# Altium schematic sheet 100-677-01-00 BCB.SchDoc: Battery Control Board (part 2 of 3)
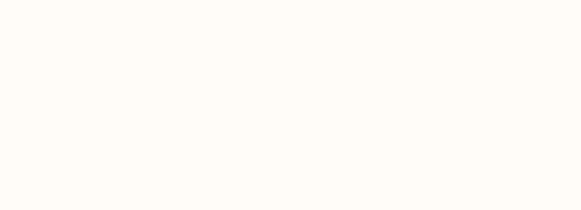
[diagram p6: 100-677-01-00 BCB.SchDoc, bottom right]
## Library data of the parts
C1 C13 C24 C33 C40 = Cap 1uF 0805: CAP MLCC 1UF 25V X7R 10% SM0805 ROHS; Manufacturer: TDK Corporation; Manufacturer Part Number: C2012X7R1E105K125AB; Capacitance: 1.0µF; Tolerance: ?0%; Supplier 1: Digi-Key; Supplier Part Number 1: 445-1354-6-ND; RoHS: RoHS Compliant; Category: Capacitors; Stock 1: 260747; Pricing 1: 1=0.16, 10=0.11, 100=0.0523, 250=0.044, 500=0.03686, 1000=0.03025 (USD); Voltage - Rated: 25V; Temperature Coefficient: X7R; Mounting Type: Surface Mount, MLCC; Operating Temperature: -55°C ~ 125°C; Applications: General Purpose; Ratings: -; Package / Case: 0805 (2012 Metric); Size / Dimension: 0.079" L x 0.049" W (2.00mm x 1.25mm); Height - Seated (Max): -; Thickness (Max): 0.057" (1.45mm); Lead Spacing: -; Features: -; Packaging: Digi-Reel畮ISHIDDEN=T; Lead Style: -; ComponentLink1URL: http://www.tdk.com/pdf/general_B11.pdf; ComponentLink1Description: http://www.tdk.com/pdf/general_B11.pdf
C2 C3 C5-C9 C12 C14 C15 C17 C20 C21 C25 C26 C28 C29 C31 C32 C34 C37 C41-C44 C103-C105 C108 C113 C114 C132 C134 = Cap 0.1uF 0603: CAP CER 0.1UF 25V 10% X7R 0603; Manufacturer Part Number 1: C0603C104K3RACTU; Manufacturer 1: Kemet; Capacitance: 0.1μF; Supplier Part Number: 399-1281-1-ND; Voltage - Rated: 25V; RoHS: RoHS Compliant; Category: Capacitors; Supplier: Digi-Key; Tolerance: ±10%; Temperature Coefficient: X7R; Mounting Type: Surface Mount, MLCC; Lead Spacing: -; Thickness (Max): 0.034" (0.87mm); Height - Seated (Max): -; Ratings: -; Size / Dimension: 0.063" L x 0.031" W (1.60mm x 0.80mm); Applications: General Purpose; Operating Temperature: -55°C ~ 125°C; Lead Style: -; Packaging: Cut Tape (CT); Package / Case: 0603 (1608 Metric); Features: -
C4 C16 C47 = Cap 10nF 0603: CAP MLCC 10NF 25V X7R 10% SM0603 ROHS; Manufacturer: TDK Corporation; Manufacturer Part Number: C1608X7R1E103K080AA; Capacitance: 10000pF; Tolerance: ?0%; Supplier 1: Digi-Key; Supplier Part Number 1: 445-5100-1-ND; Stock 1: 71278; Pricing 1: 1=0.1, 10=0.024, 100=0.011, 250=0.009, 500=0.0077, 1000=0.006 (USD); ComponentLink1URL: http://www.tdk.com/pdf/general_B11.pdf; ComponentLink1Description: http://www.tdk.com/pdf/general_B11.pdf; RoHS: RoHS Compliant; Category: Capacitors; Voltage - Rated: 25V; Temperature Coefficient: X7R; Mounting Type: Surface Mount, MLCC; Operating Temperature: -55°C ~ 125°C; Applications: General Purpose; Ratings: -; Package / Case: 0603 (1608 Metric); Size / Dimension: 0.063" L x 0.031" W (1.60mm x 0.80mm); Height - Seated (Max): -; Thickness (Max): 0.037" (0.95mm); Lead Spacing: -; Features: -; Packaging: Cut Tape (CT); Lead Style: -
C10 C19 C22 C36 C38 C46 C102 = Cap 3.3uF 0805: CAP MLCC 3.3UF 16V X5R 20% SM0805 ROHS; Manufacturer: TDK Corporation; Manufacturer Part Number: C2012X7R1C335K125AB; Capacitance: 3.3µF; Tolerance: ?0%; Temperature Coefficient: X7R; Supplier 1: Digi-Key; Supplier Part Number 1: 445-7582-1-ND; RoHS: RoHS Compliant; Category: Capacitors; Stock 1: 19266; Pricing 1: 1=0.36, 10=0.315, 100=0.1575, 250=0.126, 500=0.11476, 1000=0.1035 (USD); Voltage - Rated: 16V; Mounting Type: Surface Mount, MLCC; Operating Temperature: -55°C ~ 125°C; Applications: General Purpose; Ratings: -; Package / Case: 0805 (2012 Metric); Size / Dimension: 0.079" L x 0.049" W (2.00mm x 1.25mm); Height - Seated (Max): -; Thickness (Max): 0.057" (1.45mm); Lead Spacing: -; Features: -; Packaging: Cut Tape (CT); Lead Style: -; ComponentLink1URL: http://www.tdk.com/pdf/general_B11.pdf; ComponentLink1Description: http://www.tdk.com/pdf/general_B11.pdf
C11 C23 C39 C45 = Cap 0.47uF 0603: CAP MLCC 0.47UF 25V X5R 10% SM0603 ROHS; Manufacturer: TDK Corporation; Manufacturer Part Number: C1608X5R1E474K080AC; Capacitance: 0.47µF; Tolerance: ?0%; Supplier 1: Digi-Key; Supplier Part Number 1: 445-5144-1-ND; RoHS: RoHS Compliant; Category: Capacitors; Stock 1: 22553; Pricing 1: 1=0.15, 10=0.1, 100=0.0475, 250=0.04, 500=0.0335, 1000=0.0275 (USD); Voltage - Rated: 25V; Temperature Coefficient: X5R; Mounting Type: Surface Mount, MLCC; Operating Temperature: -55°C ~ 85°C; Applications: General Purpose; Ratings: -; Package / Case: 0603 (1608 Metric); Size / Dimension: 0.063" L x 0.031" W (1.60mm x 0.80mm); Height - Seated (Max): -; Thickness (Max): 0.037" (0.95mm); Lead Spacing: -; Features: -; Packaging: Cut Tape (CT); Lead Style: -; ComponentLink1URL: http://www.tdk.com/pdf/general_B11.pdf; ComponentLink1Description: http://www.tdk.com/pdf/general_B11.pdf
C18 = Cap 1uF 0603: CAP, CERAMIC, 1UF, 16V, X7R, 0603; Manufacturer 1: MURATA; Manufacturer Part Number 1: GRM188R71C105KA12D; Capacitance: 1; Description 1: MURATA - GRM188R71C105KA12D - CAP, CERAMIC, 1UF, 16V, X7R, 0603; Capacitance Tolerance: ± 10%; Dielectric Characteristic: X7; Voltage Rating: 16; Capacitor Case Style: 0603 [1608 Metric]; Capacitor Terminals: SMD; Supplier 1: Newark; Supplier Part Number 1: 14T3313; Stock 1: 1586; Pricing 1: 10=0.129, 250=0.097, 500=0.086, 1000=0.078, 5000=0.071 (USD); ComponentLink1URL: http://www.farnell.com/datasheets/608985.pdf; ComponentLink1Description: http://www.farnell.com/datasheets/608985.pdf; RoHS 1: YES; Operating Temperature Range: -55
C27 C30 C50 C51 C129 C130 = Cap 0.1uF 1206: CAP MLCC 0.1UF 250V 10% X7R 1206; Manufacturer: TDK Corporation; Manufacturer Part Number: C3216X7R2E104K160AA; Capacitance: 0.1µF; Tolerance: ?0%; Supplier 1: Digi-Key; Supplier Part Number 1: 445-2287-1-ND; RoHS: RoHS Compliant; Category: Capacitors; Stock 1: 169761; Pricing 1: 1=0.34, 10=0.28, 100=0.14, 250=0.105, 500=0.09276, 1000=0.08225 (USD); Voltage - Rated: 250V; Temperature Coefficient: X7R; Mounting Type: Surface Mount, MLCC; Operating Temperature: -55°C ~ 125°C; Applications: General Purpose; Ratings: -; Package / Case: 1206 (3216 Metric); Size / Dimension: 0.126" L x 0.063" W (3.20mm x 1.60mm); Height - Seated (Max): -; Thickness (Max): 0.071" (1.80mm); Lead Spacing: -; Features: -; Packaging: Cut Tape (CT); Lead Style: -; ComponentLink1URL: http://www.tdk.com/pdf/mid_volt_B11.pdf; ComponentLink1Description: http://www.tdk.com/pdf/mid_volt_B11.pdf
C48 C49 = Cap 2.2nF 1812: CAP MLCC 2.2NF 2KV 10% SM1812 ROHS; Manufacturer: TDK Corporation; Manufacturer Part Number: C4532X7R3D222K130KA; Capacitance: 2200pF; Voltage - Rated: 2000V (2kV); Tolerance: ?0%; Temperature Coefficient: X7R; Supplier 1: Digi-Key; Supplier Part Number 1: 445-2389-1-ND; RoHS: RoHS Compliant; Category: Capacitors; Stock 1: 25506; Pricing 1: 1=0.81, 10=0.689, 100=0.403, 250=0.338, 500=0.3055 (USD); Mounting Type: Surface Mount, MLCC; Operating Temperature: -55°C ~ 125°C; Applications: General Purpose; Ratings: -; Package / Case: 1812 (4532 Metric); Size / Dimension: 0.177" L x 0.126" W (4.50mm x 3.20mm); Height - Seated (Max): -; Thickness (Max): 0.059" (1.50mm); Lead Spacing: -; Features: High Voltage; Packaging: Cut Tape (CT); Lead Style: -; ComponentLink1URL: http://www.tdk.com/pdf/high_volt_B11.pdf; ComponentLink1Description: http://www.tdk.com/pdf/high_volt_B11.pdf
C52 C106 C107 C123 C124 = Cap NP 0603: Do not Populate
C100 C101 = Cap 2.2uF 0805: CAP CER 2.2UF 6.3V 20% X5R 0805; Manufacturer 1: TDK Corporation; Manufacturer Part Number: C2012X5R0J225M085AA; Capacitance: 2.2μF; Category 1: Capacitors; Supplier 1: Digi-Key; Supplier Part Number 1: 445-7667-1-ND; Stock 1: 7050; Pricing 1: 1=0.19, 10=0.13, 100=0.0618, 250=0.052, 500=0.04356, 1000=0.03575 (USD); Voltage - Rated: 6.3V; Tolerance: ±20%; Temperature Coefficient: X5R; Mounting Type: Surface Mount, MLCC; Operating Temperature: -55°C ~ 85°C; Applications: General Purpose; Ratings: -; Package / Case: 0805 (2012 Metric); Size / Dimension: 0.079" L x 0.049" W (2.00mm x 1.25mm); Height - Seated (Max): -; Thickness (Max): 0.037" (0.95mm); Lead Spacing: -; Features: -; Packaging: Cut Tape (CT); Lead Style: -; ComponentLink1URL: http://product.tdk.com/capacitor/mlcc/en/documents/mlcc_commercial_general_en.pdf; ComponentLink1Description: http://product.tdk.com/capacitor/mlcc/en/documents/mlcc_commercial_general_en.pdf; RoHS 1: RoHS Compliant; Description 1: CAP CER 2.2UF 6.3V 20% X5R 0805
C109-C112 C115-C122 C125-C128 = Cap 2200pF 0603: ACap 2200PF 100V, X7R, 10%, 0603; Manufacturer 1: AVX; Manufacturer Part Number: 06031C222KAT2A; Capacitance: 2200; Description 1: AVX - 06031C222KAT2A - CAPACITOR CERAMIC 2200PF 100V, X7R, 10%, 0603; Dielectric Characteristic: X7; Voltage Rating: 100; Capacitor Case Style: 0603 [1608 Metric]; Capacitor Terminals: SMD; No. of Pins: 2; Supplier 1: Newark; Supplier Part Number 1: 96K4759; RoHS 1: YES; Stock 1: 41497; Pricing 1: 1=0.1, 50=0.071, 100=0.046, 500=0.034, 1000=0.023, 4000=0.015, 8000=0.014 (USD); Capacitance Tolerance: ± 10%; ComponentLink1URL: http://avx.com/docs/Catalogs/cx7r.pdf; ComponentLink1Description: http://avx.com/docs/Catalogs/cx7r.pdf
C131 C133 = Cap 10uF 1206: CAP CER 10UF 25V 10% X5R 1206; Manufacturer 1: Kemet; Manufacturer Part Number: C1206C106K3PACTU; Category 1: Capacitors; Capacitance: 10μF; Supplier 1: Digi-Key; Supplier Part Number 1: 399-6784-1-ND; RoHS 1: RoHS Compliant; Description 1: CAP CER 10UF 25V 10% X5R 1206; Stock 1: 39380; Pricing 1: 1=0.35, 10=0.294, 50=0.1656, 100=0.1472, 250=0.1104, 500=0.09752, 1000=0.08648 (USD); Voltage - Rated: 25V; Tolerance: ±10%; Temperature Coefficient: X5R; Mounting Type: Surface Mount, MLCC; Operating Temperature: -55°C ~ 85°C; Applications: General Purpose; Ratings: -; Package / Case: 1206 (3216 Metric); Size / Dimension: 0.126" L x 0.063" W (3.20mm x 1.60mm); Height - Seated (Max): -; Thickness (Max): 0.071" (1.80mm); Lead Spacing: -; Features: -; Packaging: Cut Tape (CT); Lead Style: -; ComponentLink1URL: http://www.kemet.com/datasheets&C1206C106K3PACTU; ComponentLink1Description: http://www.kemet.com/datasheets&C1206C106K3PACTU
D1 D121 = Diode Standard SOT-23: DIODE, 200mA, 250V, SOT-23; Manufacturer 1: FAIRCHILD SEMICONDUCTOR; Description 1: FAIRCHILD SEMICONDUCTOR - BAS21 - STANDARD DIODE, 200mA, 250V, SOT-23; Supplier 1: Newark; Supplier Part Number 1: 18C5749; Stock 1: 14809; Pricing 1: 1=0.133, 10=0.121, 25=0.104, 100=0.085, 250=0.067, 500=0.047, 1000=0.032, 2500=0.029 (USD); RoHS 1: YES; ComponentLink1URL: http://www.farnell.com/datasheets/82312.pdf; ComponentLink1Description: http://www.farnell.com/datasheets/82312.pdf; ComponentLink2URL: http://www.fairchildsemi.com/ds/BA/BAS21.pdf; ComponentLink2Description: http://www.fairchildsemi.com/ds/BA/BAS21.pdf; Manufacturer Part Number: BAS21
D100 = Diode Zener 5.6V SOD123: DIODE ZENER 5.6V 500MW SOD-123; Manufacturer 1: ON Semiconductor; Manufacturer Part Number: MMSZ4690T1G; Description 1: DIODE ZENER 5.6V 500MW SOD123; Category 1: Discrete Semiconductor Products; Voltage - Forward (Vf) (Max) @ If: 900mV @ 10mA; Current - Reverse Leakage @ Vr: 10μA @ 4V; Tolerance: ±5%; Supplier 1: Digi-Key; Supplier Part Number 1: MMSZ4690T1GOSTR-ND; RoHS 1: RoHS Compliant; Stock 1: 18000; Pricing 1: 3000=0.03979, 6000=0.0346, 15000=0.02941 (USD); Voltage - Zener (Nom) (Vz): 5.6V; Power - Max: 500mW; Impedance (Max) (Zzt): -; Mounting Type: Surface Mount; Package / Case: SOD-123; Supplier Device Package: SOD-123; Packaging: Tape & Reel (TR); Operating Temperature: -55°C ~ 150°C; ComponentLink1URL: http://www.onsemi.com/pub_link/Collateral/MMSZ4678T1-D.PDF; ComponentLink1Description: http://www.onsemi.com/pub_link/Collateral/MMSZ4678T1-D.PDF
D101 D102 D104-D116 DZ6 = Diode Zener 5.6V SOD123: DIODE ZENER 5.6V 500MW SOD-123; Manufacturer Part Number: MMSZ4690T1G; Manufacturer 1: ON Semiconductor; Voltage - Forward (Vf) (Max) @ If: 900mV @ 10mA; Current - Reverse Leakage @ Vr: 10μA @ 4V; Tolerance: ±5%; Description 1: DIODE ZENER 5.6V 500MW SOD123; Category 1: Discrete Semiconductor Products; Supplier 1: Digi-Key; Supplier Part Number 1: MMSZ4690T1GOSTR-ND; Stock 1: 18000; Pricing 1: 3000=0.03979, 6000=0.0346, 15000=0.02941 (USD); Voltage - Zener (Nom) (Vz): 5.6V; Power - Max: 500mW; Impedance (Max) (Zzt): -; Mounting Type: Surface Mount; Package / Case: SOD-123; Supplier Device Package: SOD-123; Packaging: Tape & Reel (TR); Operating Temperature: -55°C ~ 150°C; ComponentLink1URL: http://www.onsemi.com/pub_link/Collateral/MMSZ4678T1-D.PDF; ComponentLink1Description: http://www.onsemi.com/pub_link/Collateral/MMSZ4678T1-D.PDF; RoHS 1: RoHS Compliant
D103 = LED Green: LED YELLOW-GREEN CLR 572NM 1206; Manufacturer 1: Dialight; Manufacturer Part Number: 597-6501-607F; Millicandela Rating: 104mcd; Voltage - Forward (Vf) Typ: 2.1V; Current - Test: 20mA; Wavelength - Peak: 574nm; Viewing Angle: 70°; Lens Type: Clear; Lens Style/Size: Round with Flat Top, 1.6mm; Category 1: Optoelectronics; Supplier 1: Digi-Key; Supplier Part Number 1: 350-2308-1-ND; Stock 1: 989; Pricing 1: 1=0.56, 25=0.352, 100=0.28, 250=0.24, 500=0.208, 1000=0.16 (USD); Color: Green; Wavelength - Dominant: 572nm; Package / Case: 1206 (3216 Metric); Size / Dimension: 3.20mm L x 1.60mm W; Height: 1.10mm; Mounting Type: Surface Mount, Bottom Entry; Packaging: Cut Tape (CT); Luminous Flux @ Current - Test: -; ComponentLink1URL: http://www.dialight.com/pubs/dwg/597-RM_DS.pdf; ComponentLink1Description: http://www.dialight.com/pubs/dwg/597-RM_DS.pdf; RoHS 1: RoHS Compliant; Description 1: LED YELLOW-GREEN CLR 572NM 1206
D117 D118 = LED RED: LED RED CLR SM1206 REVERSE; Manufacturer: Dialight; Manufacturer Part Number: 597-6001-607F; Millicandela Rating: 149mcd; Voltage - Forward (Vf) Typ: 2V; Current - Test: 20mA; Wavelength - Dominant: 631nm; Wavelength - Peak: 639nm; Viewing Angle: 70皫ISHIDDEN=T; Lens Type: Clear; Lens Style/Size: Round with Flat Top, 1.6mm; Supplier 1: Digi-Key; Supplier Part Number 1: 350-2312-1-ND; RoHS: RoHS Compliant; Category: Optoelectronics; Stock 1: 6593; Pricing 1: 1=0.56, 25=0.352, 100=0.28, 250=0.24, 500=0.208, 1000=0.16 (USD); Color: Red; Package / Case: 1206 (3216 Metric); Size / Dimension: 3.20mm L x 1.60mm W; Height: 1.10mm; Mounting Type: Surface Mount, Bottom Entry; Packaging: Cut Tape (CT); Luminous Flux @ Current - Test: -; ComponentLink1URL: http://www.dialight.com/pubs/dwg/597-RM_DS.pdf; ComponentLink1Description: http://www.dialight.com/pubs/dwg/597-RM_DS.pdf
D123 D124 = Diode TVS 160V SMB: DIODE TVS 160V 600W UNI 5% SMB; Manufacturer 1: Littelfuse Inc; Manufacturer Part Number: SMBJ160A; Polarization: Unidirectional; Voltage - Breakdown: 178V; Category 1: Circuit Protection; Power (Watts): 600W; Voltage - Reverse Standoff (Typ): 160V; Supplier Device Package: SMB; Mounting Type: Surface Mount; Packaging: Tape & Reel (TR); Package / Case: DO-214AA, SMB; Supplier 1: Digi-Key; Supplier Part Number 1: SMBJ160ALFTR-ND; RoHS 1: RoHS Compliant; Description 1: DIODE TVS 160V 600W UNI 5% SMB; Stock 1: 3000; Pricing 1: 3000=0.12912, 6000=0.12079, 15000=0.11246 (USD); ComponentLink1URL: http://www.littelfuse.com/~/media/Files/Littelfuse/Technical%20Resources/Documents/Data%20Sheets/Littelfuse_TVS%20Diode_SMBJ.pdf; ComponentLink1Description: http://www.littelfuse.com/~/media/Files/Littelfuse/Technical%20Resources/Documents/Data%20Sheets/Littelfuse_TVS%20Diode_SMBJ.pdf
D125 D126 = Diode TVS 16V SMB: DIODE TVS 16V 600W UNIDIR 5% SMB; Manufacturer Part Number 1: SMBJ16A; Manufacturer 1: Littelfuse Inc; Polarization: Unidirectional; Voltage - Breakdown: 17.8V; Supplier Part Number: SMBJ16ALFCT-ND; Power (Watts): 600W; Voltage - Reverse Standoff (Typ): 16V; RoHS: RoHS Compliant; Category: Circuit Protection; Supplier Device Package: SMB; Mounting Type: Surface Mount; Packaging: Cut Tape (CT); Supplier: Digi-Key; Package / Case: DO-214AA, SMB
DZ1 DZ2 DZ4 DZ7 = Diode Zener DNP SOD123: DIODE DNP SOD123
DZ3 = Diode Zener 7.5V SOD123: DIODE ZENER 7.5V 500MW SOD123; Manufacturer 1: ON Semiconductor; Manufacturer Part Number: MMSZ4693T1G; Voltage - Forward (Vf) (Max) @ If: 900mV @ 10mA; Current - Reverse Leakage @ Vr: 10μA @ 5.7V; Tolerance: ±5%; Category 1: Discrete Semiconductor Products; Supplier 1: Digi-Key; Supplier Part Number 1: MMSZ4693T1GOSCT-ND; Stock 1: 84913; Pricing 1: 1=0.24, 10=0.223, 25=0.1604, 100=0.1247, 250=0.07836, 500=0.06678, 1000=0.0455 (USD); Voltage - Zener (Nom) (Vz): 7.5V; Power - Max: 500mW; Impedance (Max) (Zzt): -; Mounting Type: Surface Mount; Package / Case: SOD-123; Supplier Device Package: SOD-123; Packaging: Cut Tape (CT); Operating Temperature: -55°C ~ 150°C; ComponentLink1URL: http://www.onsemi.com/pub_link/Collateral/MMSZ4678T1-D.PDF; ComponentLink1Description: http://www.onsemi.com/pub_link/Collateral/MMSZ4678T1-D.PDF; RoHS 1: RoHS Compliant; Description 1: DIODE ZENER 7.5V 500MW SOD123
DZ5 = Diode Zener 5.6V Dual SOT23: DIODE ZENER DUAL 5.6V SOT23; Manufacturer: Diodes Inc; Manufacturer Part Number: AZ23C5V6-7-F; Current - Reverse Leakage @ Vr: 100nA @ 1V; Configuration: 1 Pair Common Anode; Power - Max: 300mW; Impedance (Max) (Zzt): 40 Ohm; Tolerance: ?%; Supplier 1: Digi-Key; Supplier Part Number 1: AZ23C5V6-FDICT-ND; RoHS: RoHS Compliant; Category: Discrete Semiconductor Products; Stock 1: 67142; Pricing 1: 1=0.46, 10=0.334, 25=0.2596, 100=0.1966, 250=0.13896, 500=0.11124, 1000=0.08532 (USD); Voltage - Zener (Nom) (Vz): 5.6V; Voltage - Forward (Vf) (Max) @ If: -; Mounting Type: Surface Mount; Package / Case: TO-236-3, SC-59, SOT-23-3; Supplier Device Package: SOT-23-3; Packaging: Cut Tape (CT); Operating Temperature: -65°C ~ 150°C; ComponentLink1URL: http://www.diodes.com/datasheets/ds18003.pdf; ComponentLink1Description: http://www.diodes.com/datasheets/ds18003.pdf
DZ9 = Diode Zener 25V SOD123: DIODE ZENER 25V 500MW SOD-123; Manufacturer 1: ON Semiconductor; Manufacturer Part Number 1: MMSZ4710T1G; Voltage - Forward (Vf) (Max) @ If: 900mV @ 10mA; Current - Reverse Leakage @ Vr: 10nA @ 19V; Tolerance: ±5%; RoHS: RoHS Compliant; Category: Discrete Semiconductor Products; Voltage - Zener (Nom) (Vz): 25V; Power - Max: 500mW; Impedance (Max) (Zzt): -; Mounting Type: Surface Mount; Package / Case: SOD-123; Supplier Device Package: SOD-123; Packaging: Tape & Reel (TR); Operating Temperature: -55°C ~ 150°C; Supplier: Digi-Key; Supplier Part Number: MMSZ4710T1G-ND
DZ100-DZ102 = Diode Zener 16V SOD123: DIODE ZENER 16V 500MW SOD123; Manufacturer 1: ON SEMICONDUCTOR; Manufacturer Part Number: MMSZ4703T1G; Description 1: ON SEMICONDUCTOR - MMSZ4703T1G - ZENER DIODE, 500mW, 16V, SOD-123; Zener Voltage Vz Typ: 16; Power Dissipation Pd: 500; Diode Case Style: SOD-123; No. of Pins: 2; Supplier 1: Newark; Supplier Part Number 1: 71J6028; Stock 1: 6293; Pricing 1: 1=0.225, 25=0.155, 100=0.091, 250=0.08, 500=0.07, 1000=0.048, 2500=0.044, 5000=0.033 (USD); ComponentLink1URL: http://www.onsemi.com/pub/Collateral/MMSZ4678T1-D.PDF; ComponentLink1Description: http://www.onsemi.com/pub/Collateral/MMSZ4678T1-D.PDF; RoHS 1: YES; Operating Temperature Min: -55; Operating Temperature Max: 150; Diode Type: Zener
F100 F101 = FUSE 25A M-BLOW 72VDC SM3812: FUSE 20A 3AB CARTRIDGE; Manufacturer: Littelfuse Inc; Manufacturer Part Number: 0324020.HXP; Fuse Type: Cartridge, Ceramic; Voltage Rating - AC: 300V; Voltage Rating - DC: 125V; Response Time: Fast; Breaking Capacity @ Rated Voltage: 200A AC, 10000A DC; Melting I²t: 631; Approvals: CE, CSA, PSE, UL; DC Cold Resistance: 0.00355 Ohm; Supplier 1: Digi-Key; Supplier Part Number 1: F1871-ND; RoHS: RoHS Compliant; Category: Circuit Protection; Stock 1: 25; Pricing 1: 1=2.22, 10=2.009, 25=1.9036, 50=1.6216, 100=1.3748, 250=1.33952, 500=1.128, 1000=1.00463, 2500=0.95175 (USD); Current Rating: 20A; Package / Case: 3AB, 3AG, 1/4" x 1-1/4" (Axial); Mounting Type: Through Hole; Operating Temperature: -55°C ~ 125°C; Color: -; Size / Dimension: 0.275" Dia x 1.288" L (6.99mm x 32.72mm); Packaging: Bulk; ComponentLink1URL: http://www.littelfuse.com/data/en/Data_Sheets/Littelfuse_Fuse_314_324.pdf; ComponentLink1Description: http://www.littelfuse.com/data/en/Data_Sheets/Littelfuse_Fuse_314_324.pdf
P1 = Header 15X2: CONN, HDR 2X15P 0.1" SHROUDED SM W/PCB ALGN; Manufacturer: SAMTEC; Manufacturer Part Number: TSSH-115-01-L-DV-A; Connector Type: Board to Board; Contact Termination: Surface Mount Vertical; No. of Contacts: 30; No. of Rows: 2; Pitch Spacing: 2.54; SVHC: No SVHC (18-Jun-2012); ComponentLink1Description: http://www.samtec.com/ftppub/cpdf/TSSHESM1.pdf; ComponentLink1URL: http://www.samtec.com/ftppub/cpdf/TSSHESM1.pdf; Contact Material: Phosphor Bronze; Contact Plating: Gold; Gender: Header; Pricing 1: 1=5.94, 10=3.96, 100=2.583, 250=2.201, 500=1.98, 1000=1.779 (GBP); RoHS: YES; Series: TSSH; Stock 1: 100; Supplier 1: Avnet Express; Supplier Part Number 1: TSSH-115-01-L-DV-A
P2 = Header 25X2: CONN, HDR 2X25 0.1" SHROUDED SM W/PCB ALGN; Manufacturer: SAMTEC; Manufacturer Part Number: TSSH-125-01-L-DV-A; Pricing 1: 1=5.28, 5000=4.64, 10000=4.36 (USD); RoHS: YES; Stock 1: 100; Supplier 1: Newark; Supplier Part Number 1: 79P1223
P100 = Header 8x1 1.55mm: MOLEX - 87438-0842 - HEADER, 1.5MM, R/A, 8WAY; Supplier 1: Farnell; Supplier Part Number 1: 1756939; Manufacturer 1: MOLEX; Manufacturer Part Number 1: 87438-0842; RoHS 1: YES; Description 1: MOLEX - 87438-0842 - HEADER, 1.5MM, R/A, 8WAY; Pricing 1: 10=0.27, 50=0.26, 100=0.23, 250=0.181, 500=0.161 (GBP); ComponentLink1URL: http://www.farnell.com/cad/61365.pdf; ComponentLink1Description: http://www.farnell.com/cad/61365.pdf
Q1 = MOSFET N 20V 1.3A: XSTR, MOSFET, N-CH, 20V, 1.3A, SOT-23; Manufacturer 1: Alpha & Omega Semiconductor Inc; Power - Max: 1.4W; Input Capacitance (Ciss) @ Vds: 390pF @ 15V; FET Type: MOSFET N-Channel, Metal Oxide; Rds On (Max) @ Id, Vgs: 55 mOhm @ 4A, 10V; FET Feature: Logic Level Gate; Drain to Source Voltage (Vdss): 30V; Current - Continuous Drain (Id) @ 25° C: 4A; Vgs(th) (Max) @ Id: 1.4V @ 250μA; Gate Charge (Qg) @ Vgs: 4.34nC @ 4.5V; Supplier 1: Digi-Key; Supplier Part Number 1: NDS331NCT-ND; RoHS: RoHS Compliant; Supplier Device Package: SOT-23-3; Packaging: Cut Tape (CT); Package / Case: TO-236-3, SC-59, SOT-23-3; Supplier: Digi-Key; Supplier Part Number: 785-1002-1-ND; Mounting Type: Surface Mount; Supplier 2: Digi-Key; Supplier Part Number 2: 785-1002-1-ND; Category: Discrete Semiconductor Products; Manufacturer Part Number 1: AO3402
Q2 Q4 Q6 Q8 Q11-Q13 Q15 Q17 Q19-Q22 Q25 Q26 = MOSFET N 20V 1.3A: XSTR, MOSFET, N-CH, 20V, 1.3A, SOT-23; Manufacturer 1: Alpha & Omega Semiconductor Inc; FET Type: MOSFET N-Channel, Metal Oxide; FET Feature: Logic Level Gate; Drain to Source Voltage (Vdss): 30V; Rds On (Max) @ Id, Vgs: 55 mOhm @ 4A, 10V; Vgs(th) (Max) @ Id: 1.4V @ 250μA; Gate Charge (Qg) @ Vgs: 4.34nC @ 4.5V; Input Capacitance (Ciss) @ Vds: 390pF @ 15V; Power - Max: 1.4W; Current - Continuous Drain (Id) @ 25° C: 4A; Supplier 1: Digi-Key; Supplier Part Number 1: NDS331NCT-ND; RoHS: RoHS Compliant; Mounting Type: Surface Mount; Package / Case: TO-236-3, SC-59, SOT-23-3; Supplier Device Package: SOT-23-3; Packaging: Cut Tape (CT); Supplier 2: Digi-Key; Supplier Part Number 2: 785-1002-1-ND; Supplier: Digi-Key; Supplier Part Number: 785-1002-1-ND; Category: Discrete Semiconductor Products; Manufacturer Part Number 1: AO3402
Q3 Q5 = MOSFET P 50V 130MA SOT23-3: MOSFET P-CH 50V 130MA SOT23-3; Manufacturer 1: Diodes Inc; FET Type: MOSFET P-Channel, Metal Oxide; FET Feature: Logic Level Gate; Rds On (Max) @ Id, Vgs: 10 Ohm @ 100mA, 5V; Vgs(th) (Max) @ Id: 2V @ 1mA; Input Capacitance (Ciss) @ Vds: 45pF @ 25V; Power - Max: 300mW; Category 1: Discrete Semiconductor Products; Supplier 1: Digi-Key; Supplier Part Number 1: BSS84-FDICT-ND; Stock 1: 28026; Pricing 1: 1=0.39, 10=0.278, 25=0.2164, 100=0.1638, 250=0.1158, 500=0.0927, 1000=0.0711 (USD); Drain to Source Voltage (Vdss): 50V; Gate Charge (Qg) @ Vgs: -; Mounting Type: Surface Mount; Package / Case: TO-236-3, SC-59, SOT-23-3; Supplier Device Package: SOT-23-3; Packaging: Cut Tape (CT); ComponentLink1URL: http://www.diodes.com/datasheets/ds30149.pdf; ComponentLink1Description: http://www.diodes.com/datasheets/ds30149.pdf; RoHS 1: RoHS Compliant; Description 1: MOSFET P-CH 50V 130MA SOT23-3; Current - Continuous Drain (Id) @ 25° C: 130mA; Manufacturer Part Number: BSS84-7-F
Q7 Q16 Q18 = BSS123-7-F: XSTR, MOSFET, N-CH, 100V, 0.17A, SOT-23; Manufacturer: Diodes Inc; FET Type: MOSFET N-Channel, Metal Oxide; FET Feature: Standard; Current - Continuous Drain (Id) @ 25?C: 170mA; Rds On (Max) @ Id, Vgs: 6 Ohm @ 170mA, 10V; Vgs(th) (Max) @ Id: 2V @ 1mA; Input Capacitance (Ciss) @ Vds: 60pF @ 25V; Power - Max: 300mW; Supplier 1: Digi-Key; Supplier Part Number 1: BSS123-FDICT-ND; Manufacturer Part Number: BSS123-7-F; RoHS: RoHS Compliant; Category: Discrete Semiconductor Products; Stock 1: 39780; Pricing 1: 1=0.35, 10=0.322, 25=0.2316, 100=0.1803, 250=0.11324, 500=0.0965, 1000=0.06575 (USD); Drain to Source Voltage (Vdss): 100V; Gate Charge (Qg) @ Vgs: -; Mounting Type: Surface Mount; Package / Case: TO-236-3, SC-59, SOT-23-3; Supplier Device Package: SOT-23-3; Packaging: Cut Tape (CT); ComponentLink1URL: http://www.diodes.com/datasheets/ds30366.pdf; ComponentLink1Description: http://www.diodes.com/datasheets/ds30366.pdf
Q9 = MOSFET N 100V 1.7A SOT223: XSTR, MOSFET, N-CH, 100V, 1.7A, SOT-223; Manufacturer: Fairchild Semiconductor; FET Type: MOSFET N-Channel, Metal Oxide; FET Feature: Logic Level Gate; Rds On (Max) @ Id, Vgs: 350 mOhm @ 850mA, 10V; Vgs(th) (Max) @ Id: 2V @ 250µA; Gate Charge (Qg) @ Vgs: 6nC @ 5V; Input Capacitance (Ciss) @ Vds: 290pF @ 25V; Power - Max: 2W; Supplier 1: Digi-Key; Supplier Part Number 1: FQT7N10LTFCT-ND; Manufacturer Part Number: FQT7N10LTF; RoHS: RoHS Compliant; Category: Discrete Semiconductor Products; Stock 1: 173167; Pricing 1: 1=0.54, 10=0.452, 25=0.396, 100=0.339, 250=0.294, 500=0.24902, 1000=0.19198 (USD); Drain to Source Voltage (Vdss): 100V; Current - Continuous Drain (Id) @ 25?C: 1.7A; Mounting Type: Surface Mount; Package / Case: TO-261-4, TO-261AA; Supplier Device Package: SOT-223-3; Packaging: Cut Tape (CT); ComponentLink1URL: http://www.fairchildsemi.com/ds/FQ/FQT7N10L.pdf; ComponentLink1Description: http://www.fairchildsemi.com/ds/FQ/FQT7N10L.pdf
Q10 Q24 Q100-Q103 = MOSFET N 60V 115MA SOT-23: XSTR, MOSFET, N-CH, 60V, 115MA, SOT-23; Manufacturer: ON Semiconductor; Manufacturer Part Number: 2N7002LT3G; FET Type: MOSFET N-Channel, Metal Oxide; FET Feature: Logic Level Gate; Rds On (Max) @ Id, Vgs: 7.5 Ohm @ 500mA, 10V; Vgs(th) (Max) @ Id: 2.5V @ 250µA; Input Capacitance (Ciss) @ Vds: 50pF @ 25V; Power - Max: 225mW; Supplier 1: Digi-Key; Supplier Part Number 1: 2N7002LT3GOSCT-ND; RoHS: RoHS Compliant; Category: Discrete Semiconductor Products; Stock 1: 54053; Pricing 1: 1=0.15, 10=0.139, 25=0.1264, 100=0.0908, 250=0.05352, 500=0.0444, 1000=0.03028, 2500=0.02578, 5000=0.02323 (USD); Drain to Source Voltage (Vdss): 60V; Current - Continuous Drain (Id) @ 25?C: 115mA; Gate Charge (Qg) @ Vgs: -; Mounting Type: Surface Mount; Package / Case: TO-236-3, SC-59, SOT-23-3; Supplier Device Package: SOT-23-3 (TO-236); Packaging: Cut Tape (CT); ComponentLink1URL: http://www.onsemi.com/pub_link/Collateral/2N7002L-D.PDF; ComponentLink1Description: http://www.onsemi.com/pub_link/Collateral/2N7002L-D.PDF
Q14 = MOSFET P 100V 600MA: MOSFET P-CH 100V 600MA SOT23-3; Manufacturer: Diodes Inc; FET Type: MOSFET P-Channel, Metal Oxide; FET Feature: Logic Level Gate; Rds On (Max) @ Id, Vgs: 1 Ohm @ 600mA, 10V; Vgs(th) (Max) @ Id: 4V @ 250µA; Gate Charge (Qg) @ Vgs: 3.5nC @ 10V; Input Capacitance (Ciss) @ Vds: 141pF @ 50V; Power - Max: 625mW; Supplier 1: Digi-Key; Supplier Part Number 1: ZXMP10A13FCT-ND; Manufacturer Part Number: ZXMP10A13FTA; RoHS: RoHS Compliant; Category: Discrete Semiconductor Products; Stock 1: 9927; Pricing 1: 1=0.62, 10=0.519, 25=0.4548, 100=0.3893, 250=0.33768, 500=0.28602, 1000=0.2205 (USD); Drain to Source Voltage (Vdss): 100V; Current - Continuous Drain (Id) @ 25?C: 600mA; Mounting Type: Surface Mount; Package / Case: TO-236-3, SC-59, SOT-23-3; Supplier Device Package: SOT-23-3; Packaging: Cut Tape (CT); ComponentLink1URL: http://www.diodes.com/datasheets/ZXMP10A13F.pdf; ComponentLink1Description: http://www.diodes.com/datasheets/ZXMP10A13F.pdf
Q23 = MOSFET P 200V 35MA: XSTR MOSFET P-CH 200V 35MA SOT23-3; Manufacturer: Diodes Inc; FET Type: MOSFET P-Channel, Metal Oxide; FET Feature: Logic Level Gate; Rds On (Max) @ Id, Vgs: 80 Ohm @ 50mA, 10V; Vgs(th) (Max) @ Id: 3.5V @ 1mA; Input Capacitance (Ciss) @ Vds: 50pF @ 25V; Power - Max: 330mW; Supplier 1: Digi-Key; Supplier Part Number 1: ZVP1320FCT-ND; Manufacturer Part Number: ZVP1320FTA; RoHS: RoHS Compliant; Category: Discrete Semiconductor Products; Stock 1: 71346; Pricing 1: 1=0.59, 10=0.494, 25=0.4332, 100=0.3708, 250=0.3216, 500=0.2724, 1000=0.21 (USD); Drain to Source Voltage (Vdss): 200V; Current - Continuous Drain (Id) @ 25?C: 35mA; Gate Charge (Qg) @ Vgs: -; Mounting Type: Surface Mount; Package / Case: TO-236-3, SC-59, SOT-23-3; Supplier Device Package: SOT-23-3; Packaging: Cut Tape (CT); ComponentLink1URL: http://www.diodes.com/datasheets/ZVP1320F.pdf; ComponentLink1Description: http://www.diodes.com/datasheets/ZVP1320F.pdf
Q27-Q32 = MOSFET N 200V 88A SM-TO263-3: XSTR, MOSFET, N-CH, 200V, 88A, SM TO-263-3; Manufacturer: Infineon Technologies; FET Type: MOSFET N-Channel, Metal Oxide; FET Feature: Logic Level Gate; Rds On (Max) @ Id, Vgs: 10.7 mOhm @ 88A, 10V; Vgs(th) (Max) @ Id: 4V @ 270µA; Gate Charge (Qg) @ Vgs: 87nC @ 10V; Input Capacitance (Ciss) @ Vds: 7100pF @ 100V; Power - Max: 300W; Supplier 1: Digi-Key; Supplier Part Number 1: IPB107N20N3 GCT-ND; Manufacturer Part Number: IPB107N20N3 G; RoHS: RoHS Compliant; Category: Discrete Semiconductor Products; Stock 1: 1641; Pricing 1: 1=8.54, 10=7.738, 25=7.0932, 100=6.4482, 250=5.8034, 500=5.31976 (USD); Drain to Source Voltage (Vdss): 200V; Current - Continuous Drain (Id) @ 25?C: 88A; Mounting Type: Surface Mount; Package / Case: TO-263-3, D²Pak (2 Leads + Tab), TO-263AB; Supplier Device Package: PG-TO263-2; Packaging: Cut Tape (CT); ComponentLink1URL: http://www.infineon.com/dgdl/IPP_I_110N20N3+G_IPB107N20N3+G+Rev2.2.pdf?folderId=db3a3043163797a6011637d4bae7003b&fileId=db3a3043243b5f170124968e7d1f18e7; ComponentLink1Description: http://www.infineon.com/dgdl/IPP_I_110N20N3+G_IPB107N20N3+G+Rev2.2.pdf?folderId=db3a3043163797a6011637d4bae7003b&fileId=db3a3043243b5f170124968e7d1f18e7
Q33 = MOSFET N 200V 60MA: XSTR MOSFET N-CH 200V 60MA SOT23-3; Manufacturer: Diodes Inc; FET Type: MOSFET N-Channel, Metal Oxide; FET Feature: Standard; Rds On (Max) @ Id, Vgs: 25 Ohm @ 100mA, 10V; Vgs(th) (Max) @ Id: 3V @ 1mA; Input Capacitance (Ciss) @ Vds: 45pF @ 25V; Power - Max: 330mW; Supplier 1: Digi-Key; Supplier Part Number 1: ZVN3320FCT-ND; Manufacturer Part Number: ZVN3320FTA; RoHS: RoHS Compliant; Category: Discrete Semiconductor Products; Stock 1: 19783; Pricing 1: 1=0.46, 10=0.391, 25=0.3428, 100=0.2936, 250=0.2546, 500=0.21566, 1000=0.16625 (USD); Drain to Source Voltage (Vdss): 200V; Current - Continuous Drain (Id) @ 25?C: 60mA; Gate Charge (Qg) @ Vgs: -; Mounting Type: Surface Mount; Package / Case: TO-236-3, SC-59, SOT-23-3; Supplier Device Package: SOT-23-3; Packaging: Cut Tape (CT); ComponentLink1URL: http://www.diodes.com/datasheets/ZVN3320F.pdf; ComponentLink1Description: http://www.diodes.com/datasheets/ZVN3320F.pdf
R1 R23 R40 R68 R108 R119 R120 R126 = Res 51 0603: RES 51 OHM 1/10W 5% SM0603; Manufacturer: Yageo; Manufacturer Part Number: RC0603JR-0751RL; Power (Watts): 0.1W, 1/10W; Temperature Coefficient: ?00ppm/°C; Tolerance: ?%; Supplier 1: Digi-Key; Supplier Part Number 1: 311-51GRCT-ND; RoHS: RoHS Compliant; Category: Resistors; Stock 1: 162700; Pricing 1: 1=0.1, 10=0.01, 25=0.008, 100=0.0048, 250=0.00416, 500=0.00294, 1000=0.00207, 2500=0.0018 (USD); Resistance (Ohms): 51; Composition: Thick Film; Features: -; Package / Case: 0603 (1608 Metric); Supplier Device Package: 0603; Size / Dimension: 0.063" L x 0.031" W (1.60mm x 0.80mm); Height: 0.022" (0.55mm); Number of Terminations: 2; Packaging: Cut Tape (CT); ComponentLink1URL: http://www.yageo.com/documents/recent/PYu-RC0603_51_RoHS_L_4.pdf; ComponentLink1Description: http://www.yageo.com/documents/recent/PYu-RC0603_51_RoHS_L_4.pdf
R2 R4 R9 R16 R24 R30 R34 R36 R41 R51 R59 R65 R69 R73 R76 R81 = Res 330 0603: RES 330 OHM 1/10W 5% 0603 SMD; Manufacturer: Yageo; Manufacturer Part Number: RC0603JR-07330RL; Power (Watts): 0.1W, 1/10W; Temperature Coefficient: ?00ppm/°C; Tolerance: ?%; Supplier 1: Digi-Key; Supplier Part Number 1: 311-330GRTR-ND; RoHS: RoHS Compliant; Category: Resistors; Stock 1: 380000; Pricing 1: 5000=0.00131, 10000=0.00114, 25000=0.001, 50000=0.00092, 125000=0.0009 (USD); Resistance (Ohms): 330; Composition: Thick Film; Features: -; Package / Case: 0603 (1608 Metric); Supplier Device Package: 0603; Size / Dimension: 0.063" L x 0.031" W (1.60mm x 0.80mm); Height: 0.022" (0.55mm); Number of Terminations: 2; Packaging: Tape & Reel (TR); ComponentLink1URL: http://www.yageo.com/documents/recent/PYu-RC0603_51_RoHS_L_4.pdf; ComponentLink1Description: http://www.yageo.com/documents/recent/PYu-RC0603_51_RoHS_L_4.pdf
R3A R3B R3C R5A R5B R5C R10A R10B R10C R17A R17B R17C R27A R27B R27C R32A R32B R32C R35A R35B R35C R37A R37B R37C R44A R44B R44C R54A R54B R54C R62A R62B R62C R66A R66B R66C R72A R72B R72C R74A R74B R74C R78A R78B R78C R82A R82B R82C = Res 68 2512: RES 68 OHM 1W 5% 2512 SMD; Manufacturer: Panasonic Electronic Components; Manufacturer Part Number: ERJ-1TYJ680U; Temperature Coefficient: ?00ppm/°C; Tolerance: ?%; Supplier 1: Digi-Key; Supplier Part Number 1: PT68XCT-ND; RoHS: RoHS Compliant; Category: Resistors; Stock 1: 41763; Pricing 1: 1=0.8, 50=0.33, 100=0.2727, 250=0.21524, 500=0.18368, 1000=0.13776 (USD); Resistance (Ohms): 68; Power (Watts): 1W; Composition: Thick Film; Features: -; Package / Case: 2512 (6432 Metric); Supplier Device Package: 2512; Size / Dimension: 0.252" L x 0.126" W (6.40mm x 3.20mm); Height: 0.028" (0.70mm); Number of Terminations: 2; Packaging: Cut Tape (CT); ComponentLink1URL: http://industrial.panasonic.com/www-cgi/jvcr13pz.cgi?E+PZ+3+AOA0001+ERJ1TYJ680U+7+WW; ComponentLink1Description: http://industrial.panasonic.com/www-cgi/jvcr13pz.cgi?E+PZ+3+AOA0001+ERJ1TYJ680U+7+WW
R6 R11 R18 R19 = Res 200K 0603: RES 200K OHM 1/10W 1% 0603 SMD; Manufacturer 1: Yageo; Manufacturer Part Number 1: RC0603FR-07200KL; Power (Watts): 0.1W, 1/10W; Temperature Coefficient: ±100ppm/°C; Category 1: Resistors; Supplier 1: Digi-Key; Supplier Part Number 1: 311-200KHRTR-ND; Stock 1: 205000; Pricing 1: 5000=0.00171, 10000=0.00149, 25000=0.00131, 50000=0.0012, 125000=0.00117 (USD); Resistance (Ohms): 200k; Composition: Thick Film; Features: -; Tolerance: ±1%; Package / Case: 0603 (1608 Metric); Supplier Device Package: 0603; Size / Dimension: 0.063" L x 0.031" W (1.60mm x 0.80mm); Height: 0.022" (0.55mm); Number of Terminations: 2; Packaging: Tape & Reel (TR); ComponentLink1URL: http://www.yageo.com/documents/recent/PYu-RC0603_51_RoHS_L_4.pdf; ComponentLink1Description: http://www.yageo.com/documents/recent/PYu-RC0603_51_RoHS_L_4.pdf; RoHS 1: RoHS Compliant; Description 1: RES 200K OHM 1/10W 1% 0603 SMD
R12-R15 R29 R103 = Res 20K 0603: RES 20.0K OHM 1/10W 1% 0603 SMD; Manufacturer 1: Yageo; Manufacturer Part Number 1: RC0603FR-0720KL; Power (Watts): 0.1W, 1/10W; Temperature Coefficient: ±100ppm/°C; Category 1: Resistors; Supplier 1: Digi-Key; Supplier Part Number 1: 311-20.0KHRTR-ND; Stock 1: 1015000; Pricing 1: 5000=0.00171, 10000=0.00149, 25000=0.00131, 50000=0.0012, 125000=0.00117 (USD); Resistance (Ohms): 20k; Composition: Thick Film; Features: -; Tolerance: ±1%; Package / Case: 0603 (1608 Metric); Supplier Device Package: 0603; Size / Dimension: 0.063" L x 0.031" W (1.60mm x 0.80mm); Height: 0.022" (0.55mm); Number of Terminations: 2; Packaging: Tape & Reel (TR); ComponentLink1URL: http://www.yageo.com/documents/recent/PYu-RC0603_51_RoHS_L_4.pdf; ComponentLink1Description: http://www.yageo.com/documents/recent/PYu-RC0603_51_RoHS_L_4.pdf; RoHS 1: RoHS Compliant; Description 1: RES 20.0K OHM 1/10W 1% 0603 SMD
R22 R53 R55 R56 R77 R79 R110 R112 R113 = Res 1M 0603 5%: RES 1.0M OHM 1/10W 5% 0603 SMD; Manufacturer 1: Yageo; Manufacturer Part Number 1: RC0603JR-071ML; Power (Watts): 0.1W, 1/10W; Temperature Coefficient: ±100ppm/°C; Category 1: Resistors; Supplier 1: Digi-Key; Supplier Part Number 1: 311-1.0MGRTR-ND; Stock 1: 1645000; Pricing 1: 5000=0.00131, 10000=0.00114, 25000=0.001, 50000=0.00092, 125000=0.0009 (USD); Resistance (Ohms): 1M; Composition: Thick Film; Features: -; Tolerance: ±5%; Package / Case: 0603 (1608 Metric); Supplier Device Package: 0603; Size / Dimension: 0.063" L x 0.031" W (1.60mm x 0.80mm); Height: 0.022" (0.55mm); Number of Terminations: 2; Packaging: Tape & Reel (TR); ComponentLink1URL: http://www.yageo.com/documents/recent/PYu-RC0603_51_RoHS_L_4.pdf; ComponentLink1Description: http://www.yageo.com/documents/recent/PYu-RC0603_51_RoHS_L_4.pdf; RoHS 1: RoHS Compliant; Description 1: RES 1.0M OHM 1/10W 5% 0603 SMD
R25 R26 R42 R43 R70 R71 = Res 1K 0603: RES 1.00K OHM 1/10W 1% 0603 SMD; Manufacturer 1: Yageo; Manufacturer Part Number: RC0603FR-071KL; Power (Watts): 0.1W, 1/10W; Temperature Coefficient: ±100ppm/°C; Category 1: Resistors; Supplier 1: Digi-Key; Supplier Part Number 1: 311-1.00KHRTR-ND; Stock 1: 4960000; Pricing 1: 5000=0.00171, 10000=0.00149, 25000=0.00131, 50000=0.0012, 125000=0.00117 (USD); Resistance (Ohms): 1k; Composition: Thick Film; Features: -; Tolerance: ±1%; Package / Case: 0603 (1608 Metric); Supplier Device Package: 0603; Size / Dimension: 0.063" L x 0.031" W (1.60mm x 0.80mm); Height: 0.022" (0.55mm); Number of Terminations: 2; Packaging: Tape & Reel (TR); ComponentLink1URL: http://www.yageo.com/documents/recent/PYu-RC0603_51_RoHS_L_4.pdf; ComponentLink1Description: http://www.yageo.com/documents/recent/PYu-RC0603_51_RoHS_L_4.pdf; RoHS 1: RoHS Compliant; Description 1: RES 1.00K OHM 1/10W 1% 0603 SMD
R28 = Res 280K  0603: RES 280K OHM 1/10W 1% 0603 SMD; Manufacturer 1: Yageo; Manufacturer Part Number 1: RC0603FR-07280KL; Power (Watts): 0.1W, 1/10W; Temperature Coefficient: ±100ppm/°C; Category 1: Resistors; Supplier 1: Digi-Key; Supplier Part Number 1: 311-280KHRCT-ND; Stock 1: 323095; Pricing 1: 1=0.1, 10=0.014, 25=0.0104, 100=0.0063, 250=0.0054, 500=0.00382, 1000=0.0027, 2500=0.00234 (USD); Resistance (Ohms): 280k; Composition: Thick Film; Features: -; Tolerance: ±1%; Package / Case: 0603 (1608 Metric); Supplier Device Package: 0603; Size / Dimension: 0.063" L x 0.031" W (1.60mm x 0.80mm); Height: 0.022" (0.55mm); Number of Terminations: 2; Packaging: Cut Tape (CT); ComponentLink1URL: http://www.yageo.com/documents/recent/PYu-RC0603_51_RoHS_L_4.pdf; ComponentLink1Description: http://www.yageo.com/documents/recent/PYu-RC0603_51_RoHS_L_4.pdf; RoHS 1: RoHS Compliant; Description 1: RES 280K OHM 1/10W 1% 0603 SMD
R31 R63 = Res 510K 0805: RES 510K OHM 1/8W 5% SM0805; Manufacturer: Yageo; Manufacturer Part Number: RC0805JR-07510KL; Power (Watts): 0.125W, 1/8W; Temperature Coefficient: ?00ppm/°C; Tolerance: ?%; Supplier 1: Digi-Key; Supplier Part Number 1: 311-510KARCT-ND; RoHS: RoHS Compliant; Category: Resistors; Stock 1: 24961; Pricing 1: 1=0.1, 10=0.017, 25=0.0128, 100=0.0077, 250=0.0066, 500=0.00468, 1000=0.0033, 2500=0.00286 (USD); Resistance (Ohms): 510k; Composition: Thick Film; Features: -; Package / Case: 0805 (2012 Metric); Supplier Device Package: 0805; Size / Dimension: 0.079" L x 0.049" W (2.00mm x 1.25mm); Height: 0.024" (0.60mm); Number of Terminations: 2; Packaging: Cut Tape (CT); ComponentLink1URL: http://www.yageo.com/documents/recent/PYu-RC0805_51_RoHS_L_4.pdf; ComponentLink1Description: http://www.yageo.com/documents/recent/PYu-RC0805_51_RoHS_L_4.pdf
R33 R64 = Res 1 0603: RESISTOR, 1R, 100MW, 5%; Manufacturer 1: PANASONIC; Manufacturer Part Number 1: ERJ3GEYJ1R0V; Description 1: PANASONIC - ERJ3GEYJ1R0V - RESISTOR, 1R, 100MW, 5%; Supplier 1: Farnell; Supplier Part Number 1: 2059528RL; RoHS 1: YES; Stock 1: 18401; Pricing 1: 50=0.007, 100=0.005, 500=0.004, 1000=0.003 (GBP); ComponentLink1URL: http://www.farnell.com/datasheets/1500035.pdf; ComponentLink1Description: http://www.farnell.com/datasheets/1500035.pdf
R38 R86 R107 R132 = Res NP 0603: Do not Populate
R45 = Res 430K 0603: RES 430K OHM 1/10W 1% 0603 SMD; Manufacturer 1: Panasonic Electronic Components; Manufacturer Part Number 1: ERJ-3EKF4303V; Power (Watts): 0.1W, 1/10W; Temperature Coefficient: ±100ppm/°C; Category 1: Resistors; Supplier 1: Digi-Key; Supplier Part Number 1: P430KHCT-ND; Stock 1: 71347; Pricing 1: 1=0.1, 50=0.0138, 100=0.0105, 250=0.0078, 500=0.00576, 1000=0.00384 (USD); Resistance (Ohms): 430k; Composition: Thick Film; Features: -; Tolerance: ±1%; Package / Case: 0603 (1608 Metric); Supplier Device Package: 0603; Size / Dimension: 0.063" L x 0.031" W (1.60mm x 0.80mm); Height: 0.022" (0.55mm); Number of Terminations: 2; Packaging: Cut Tape (CT); ComponentLink1URL: http://industrial.panasonic.com/www-cgi/jvcr13pz.cgi?E+PZ+3+AOA0002+ERJ3EKF4303V+7+WW; ComponentLink1Description: http://industrial.panasonic.com/www-cgi/jvcr13pz.cgi?E+PZ+3+AOA0002+ERJ3EKF4303V+7+WW; RoHS 1: RoHS Compliant; Description 1: RES 430K OHM 1/10W 1% 0603 SMD
R50 = Res 1.6M 0805: RES 1.6M OHM 1/8W 5% 0805 SMD; Manufacturer 1: Yageo; Manufacturer Part Number 1: RC0805JR-071M6L; Power (Watts): 0.125W, 1/8W; Temperature Coefficient: ±100ppm/°C; Category 1: Resistors; Supplier 1: Digi-Key; Supplier Part Number 1: 311-1.6MARTR-ND; Stock 1: 50000; Pricing 1: 5000=0.00209, 10000=0.00182, 25000=0.0016, 50000=0.00146, 125000=0.00143 (USD); Resistance (Ohms): 1.6M; Composition: Thick Film; Features: -; Tolerance: ±5%; Package / Case: 0805 (2012 Metric); Supplier Device Package: 0805; Size / Dimension: 0.079" L x 0.049" W (2.00mm x 1.25mm); Height: 0.024" (0.60mm); Number of Terminations: 2; Packaging: Tape & Reel (TR); ComponentLink1URL: http://media.digikey.com/pdf/Data%20Sheets/Yageo%20PDFs/RC0805%20Pb%20Free.pdf; ComponentLink1Description: http://media.digikey.com/pdf/Data%20Sheets/Yageo%20PDFs/RC0805%20Pb%20Free.pdf; RoHS 1: RoHS Compliant; Description 1: RES 1.6M OHM 1/8W 5% 0805 SMD
R52 = Res 1M 0805 .1%: RES 1M OHM 1/8W .1% 0805 SMD; Manufacturer 1: Panasonic Electronic Components; Manufacturer Part Number 1: ERA-6AEB105V; Category 1: Resistors; Power (Watts): 0.125W, 1/8W; Temperature Coefficient: ±25ppm/°C; Tolerance: ±0.1%; Supplier 1: Digi-Key; Supplier Part Number 1: P1MDATR-ND; RoHS 1: RoHS Compliant; Description 1: RES 1M OHM 1/8W .1% 0805 SMD; Stock 1: 60000; Pricing 1: 5000=0.04275, 10000=0.0399, 25000=0.03791, 50000=0.03714, 125000=0.03634 (USD); Resistance (Ohms): 1M; Composition: Thin Film; Features: -; Package / Case: 0805 (2012 Metric); Supplier Device Package: 0805; Size / Dimension: 0.079" L x 0.049" W (2.00mm x 1.25mm); Height: 0.024" (0.60mm); Number of Terminations: 2; Packaging: Tape & Reel (TR); ComponentLink1URL: http://industrial.panasonic.com/www-cgi/jvcr13pz.cgi?E+PZ+3+AOA0026+ERA6AEB105V+7+WW; ComponentLink1Description: http://industrial.panasonic.com/www-cgi/jvcr13pz.cgi?E+PZ+3+AOA0026+ERA6AEB105V+7+WW
R57 R61 R104 R106 = Res 100 0603: RES 100 OHM 1/10W 5% 0603 SMD; Manufacturer 1: Panasonic Electronic Components; Manufacturer Part Number 1: ERJ-3GEYJ101V; Power (Watts): 0.1W, 1/10W; Temperature Coefficient: ±200ppm/°C; Category 1: Resistors; Supplier 1: Digi-Key; Supplier Part Number 1: P100GCT-ND; Stock 1: 1931036; Pricing 1: 1=0.1, 50=0.0092, 100=0.007, 250=0.0052, 500=0.00384, 1000=0.00256 (USD); Resistance (Ohms): 100; Composition: Thick Film; Features: -; Tolerance: ±5%; Package / Case: 0603 (1608 Metric); Supplier Device Package: 0603; Size / Dimension: 0.063" L x 0.031" W (1.60mm x 0.80mm); Height: 0.022" (0.55mm); Number of Terminations: 2; Packaging: Cut Tape (CT); ComponentLink1URL: http://industrial.panasonic.com/www-cgi/jvcr13pz.cgi?E+PZ+3+AOA0001+ERJ3GEYJ101V+7+WW; ComponentLink1Description: http://industrial.panasonic.com/www-cgi/jvcr13pz.cgi?E+PZ+3+AOA0001+ERJ3GEYJ101V+7+WW; RoHS 1: RoHS Compliant; Description 1: RES 100 OHM 1/10W 5% 0603 SMD
R58 = Res 16.9K 0603: RES 16.9K OHM 1/10W .1% 0603 SMD; Manufacturer 1: Panasonic Electronic Components; Manufacturer Part Number 1: ERA-3AEB1692V; Power (Watts): 0.1W, 1/10W; Temperature Coefficient: ±25ppm/°C; Tolerance: ±0.1%; Category 1: Resistors; Supplier 1: Digi-Key; Supplier Part Number 1: P16.9KDBTR-ND; Stock 1: 5000; Pricing 1: 5000=0.04275, 10000=0.0399, 25000=0.03791, 50000=0.03714, 125000=0.03634 (USD); Resistance (Ohms): 16.9k; Composition: Thin Film; Features: -; Package / Case: 0603 (1608 Metric); Supplier Device Package: 0603; Size / Dimension: 0.063" L x 0.031" W (1.60mm x 0.80mm); Height: 0.022" (0.55mm); Number of Terminations: 2; Packaging: Tape & Reel (TR); ComponentLink1URL: http://industrial.panasonic.com/www-cgi/jvcr13pz.cgi?E+PZ+3+AOA0026+ERA3AEB1692V+7+WW; ComponentLink1Description: http://industrial.panasonic.com/www-cgi/jvcr13pz.cgi?E+PZ+3+AOA0026+ERA3AEB1692V+7+WW; RoHS 1: RoHS Compliant; Description 1: RES 16.9K OHM 1/10W .1% 0603 SMD
R60 = Res 100 0805: RES 100 OHM 1/8W 5% 0805 SMD; Manufacturer 1: Panasonic Electronic Components; Manufacturer Part Number 1: ERJ-6GEYJ101V; Power (Watts): 0.125W, 1/8W; Temperature Coefficient: ±200ppm/°C; Category 1: Resistors; Supplier 1: Digi-Key; Supplier Part Number 1: P100ATR-ND; Stock 1: 1305000; Pricing 1: 5000=0.00266, 10000=0.00231, 25000=0.00203, 50000=0.00186, 125000=0.00182 (USD); Resistance (Ohms): 100; Composition: Thick Film; Features: -; Tolerance: ±5%; Package / Case: 0805 (2012 Metric); Supplier Device Package: 0805; Size / Dimension: 0.079" L x 0.049" W (2.00mm x 1.25mm); Height: 0.028" (0.70mm); Number of Terminations: 2; Packaging: Tape & Reel (TR); ComponentLink1URL: http://industrial.panasonic.com/www-cgi/jvcr13pz.cgi?E+PZ+3+AOA0001+ERJ6GEYJ101V+7+WW; ComponentLink1Description: http://industrial.panasonic.com/www-cgi/jvcr13pz.cgi?E+PZ+3+AOA0001+ERJ6GEYJ101V+7+WW; RoHS 1: RoHS Compliant; Description 1: RES 100 OHM 1/8W 5% 0805 SMD
R75 R80 R105 R111 = Res 2M 0603: RES 2.0M OHM 1/10W 5% 0603 SMD; Manufacturer 1: Panasonic Electronic Components; Manufacturer Part Number 1: ERJ-3GEYJ205V; Power (Watts): 0.1W, 1/10W; Temperature Coefficient: -400/ +150ppm/°C; Category 1: Resistors; Supplier 1: Digi-Key; Supplier Part Number 1: P2.0MGTR-ND; Stock 1: 200000; Pricing 1: 5000=0.00152, 10000=0.00132, 25000=0.00116, 50000=0.00106, 125000=0.00104 (USD); Resistance (Ohms): 2M; Composition: Thick Film; Features: -; Tolerance: ±5%; Package / Case: 0603 (1608 Metric); Supplier Device Package: 0603; Size / Dimension: 0.063" L x 0.031" W (1.60mm x 0.80mm); Height: 0.022" (0.55mm); Number of Terminations: 2; Packaging: Tape & Reel (TR); ComponentLink1URL: http://industrial.panasonic.com/www-cgi/jvcr13pz.cgi?E+PZ+3+AOA0001+ERJ3GEYJ205V+7+WW; ComponentLink1Description: http://industrial.panasonic.com/www-cgi/jvcr13pz.cgi?E+PZ+3+AOA0001+ERJ3GEYJ205V+7+WW; RoHS 1: RoHS Compliant; Description 1: RES 2.0M OHM 1/10W 5% 0603 SMD
R83 = Res 51 1206: RES 51 OHM 5% 1/4W SM1206; Manufacturer: Yageo; Manufacturer Part Number: RC1206JR-0751RL; Power (Watts): 0.25W, 1/4W; Temperature Coefficient: ?00ppm/°C; Tolerance: ?%; Supplier 1: Digi-Key; Supplier Part Number 1: 311-51ERCT-ND; RoHS: RoHS Compliant; Category: Resistors; Stock 1: 27621; Pricing 1: 1=0.1, 10=0.022, 25=0.0172, 100=0.0104, 250=0.00896, 500=0.00634, 1000=0.00447, 2500=0.00388 (USD); Resistance (Ohms): 51; Composition: Thick Film; Features: -; Package / Case: 1206 (3216 Metric); Supplier Device Package: 1206; Size / Dimension: 0.122" L x 0.063" W (3.10mm x 1.60mm); Height: 0.026" (0.65mm); Number of Terminations: 2; Packaging: Cut Tape (CT); ComponentLink1URL: http://www.yageo.com/documents/recent/PYu-RC1206_51_RoHS_L_4.pdf; ComponentLink1Description: http://www.yageo.com/documents/recent/PYu-RC1206_51_RoHS_L_4.pdf
R84 = Res 10K 0805: RES 10K OHM 1/8W 5% 0805 SMD; Manufacturer 1: Panasonic Electronic Components; Manufacturer Part Number 1: ERJ-6GEYJ103V; Power (Watts): 0.125W, 1/8W; Temperature Coefficient: ±200ppm/°C; Category 1: Resistors; Supplier 1: Digi-Key; Supplier Part Number 1: P10KACT-ND; Stock 1: 3884565; Pricing 1: 1=0.1, 50=0.0162, 100=0.0122, 250=0.00908, 500=0.00672, 1000=0.00448 (USD); Resistance (Ohms): 10k; Composition: Thick Film; Features: -; Tolerance: ±5%; Package / Case: 0805 (2012 Metric); Supplier Device Package: 0805; Size / Dimension: 0.079" L x 0.049" W (2.00mm x 1.25mm); Height: 0.028" (0.70mm); Number of Terminations: 2; Packaging: Cut Tape (CT); ComponentLink1URL: http://industrial.panasonic.com/www-cgi/jvcr13pz.cgi?E+PZ+3+AOA0001+ERJ6GEYJ103V+7+WW; ComponentLink1Description: http://industrial.panasonic.com/www-cgi/jvcr13pz.cgi?E+PZ+3+AOA0001+ERJ6GEYJ103V+7+WW; RoHS 1: RoHS Compliant; Description 1: RES 10K OHM 1/8W 5% 0805 SMD
R85 R87 = Res 10K 0603: RES 10K OHM 1/10W 5% 0603 SMD; Manufacturer 1: Panasonic Electronic Components; Manufacturer Part Number 1: ERJ-3GEYJ103V; Power (Watts): 0.1W, 1/10W; Temperature Coefficient: ±200ppm/°C; Category 1: Resistors; Supplier 1: Digi-Key; Supplier Part Number 1: P10KGCT-ND; Stock 1: 16356863; Pricing 1: 1=0.1, 50=0.0092, 100=0.007, 250=0.0052, 500=0.00384, 1000=0.00256 (USD); Resistance (Ohms): 10k; Composition: Thick Film; Features: -; Tolerance: ±5%; Package / Case: 0603 (1608 Metric); Supplier Device Package: 0603; Size / Dimension: 0.063" L x 0.031" W (1.60mm x 0.80mm); Height: 0.022" (0.55mm); Number of Terminations: 2; Packaging: Cut Tape (CT); ComponentLink1URL: http://industrial.panasonic.com/www-cgi/jvcr13pz.cgi?E+PZ+3+AOA0001+ERJ3GEYJ103V+7+WW; ComponentLink1Description: http://industrial.panasonic.com/www-cgi/jvcr13pz.cgi?E+PZ+3+AOA0001+ERJ3GEYJ103V+7+WW; RoHS 1: RoHS Compliant; Description 1: RES 10K OHM 1/10W 5% 0603 SMD